# Altium schematic sheet Fdbk_1.SchDoc
size A4; SheetNumber: 5; SheetTotal: 5
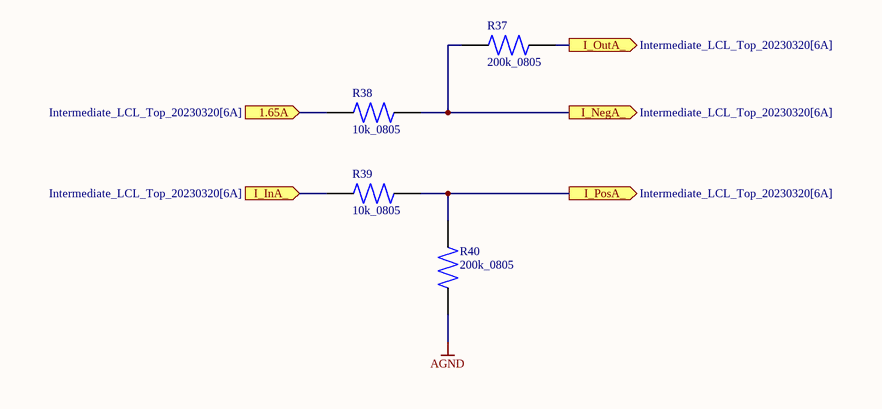
[diagram p0: Fdbk_1.SchDoc]

## Parts
R37  200k_0805  [0805 Resistor]
R38  10k_0805  [0805 Resistor]
R39  10k_0805  [0805 Resistor]
R40  200k_0805  [0805 Resistor]

## Ports
1.65A (in, see Intermediate_LCL_Top_20230320[6A]), I_InA_ (in, see Intermediate_LCL_Top_20230320[6A]), I_NegA_ (out, see Intermediate_LCL_Top_20230320[6A]), I_OutA_ (out, see Intermediate_LCL_Top_20230320[6A]), I_PosA_ (out, see Intermediate_LCL_Top_20230320[6A])

## Nets
AGND: R40.1
1.65A: R38.1 ; port 1.65A
I_InA_: R39.1 ; port I_InA_
I_NegA_: R37.1 R38.2 ; port I_NegA_
I_OutA_: R37.2 ; port I_OutA_
I_PosA_: R39.2 R40.2 ; port I_PosA_

## Library data of the parts
R37 R40 = CRCW0805200KFKEA: SMD Chip Resistor, 200 kohm, ± 1%, 125 mW, 0805 [2012 Metric], Thick Film, General Purpose; MF: Bourns; MP: CRE2512-FZ-R007E-3; Mouser-Purchase-URL: https://snapeda.com/shop?store=Mouser&id=836123; Price: None; Package: 6432 Stackpole; Value: *; SnapEDA_Link: https://www.snapeda.com/parts/CRE2512-FZ-R007E-3/Bourns/view-part/836123/?ref=snap; DigiKey-Purchase-URL: https://snapeda.com/shop?store=DigiKey&id=836123; Availability: Good
R38 R39 = CRCW080510K0FKEA: SMD Chip Resistor, 10 kohm, ± 1%, 125 mW, 0805 [2012 Metric], Thick Film, General Purpose; MF: Bourns; MP: CRE2512-FZ-R007E-3; Mouser-Purchase-URL: https://snapeda.com/shop?store=Mouser&id=836123; Price: None; Package: 6432 Stackpole; Value: *; SnapEDA_Link: https://www.snapeda.com/parts/CRE2512-FZ-R007E-3/Bourns/view-part/836123/?ref=snap; DigiKey-Purchase-URL: https://snapeda.com/shop?store=DigiKey&id=836123; Availability: Good